# EAGLE schematic homeboard1tmp (EAGLE 6.0)
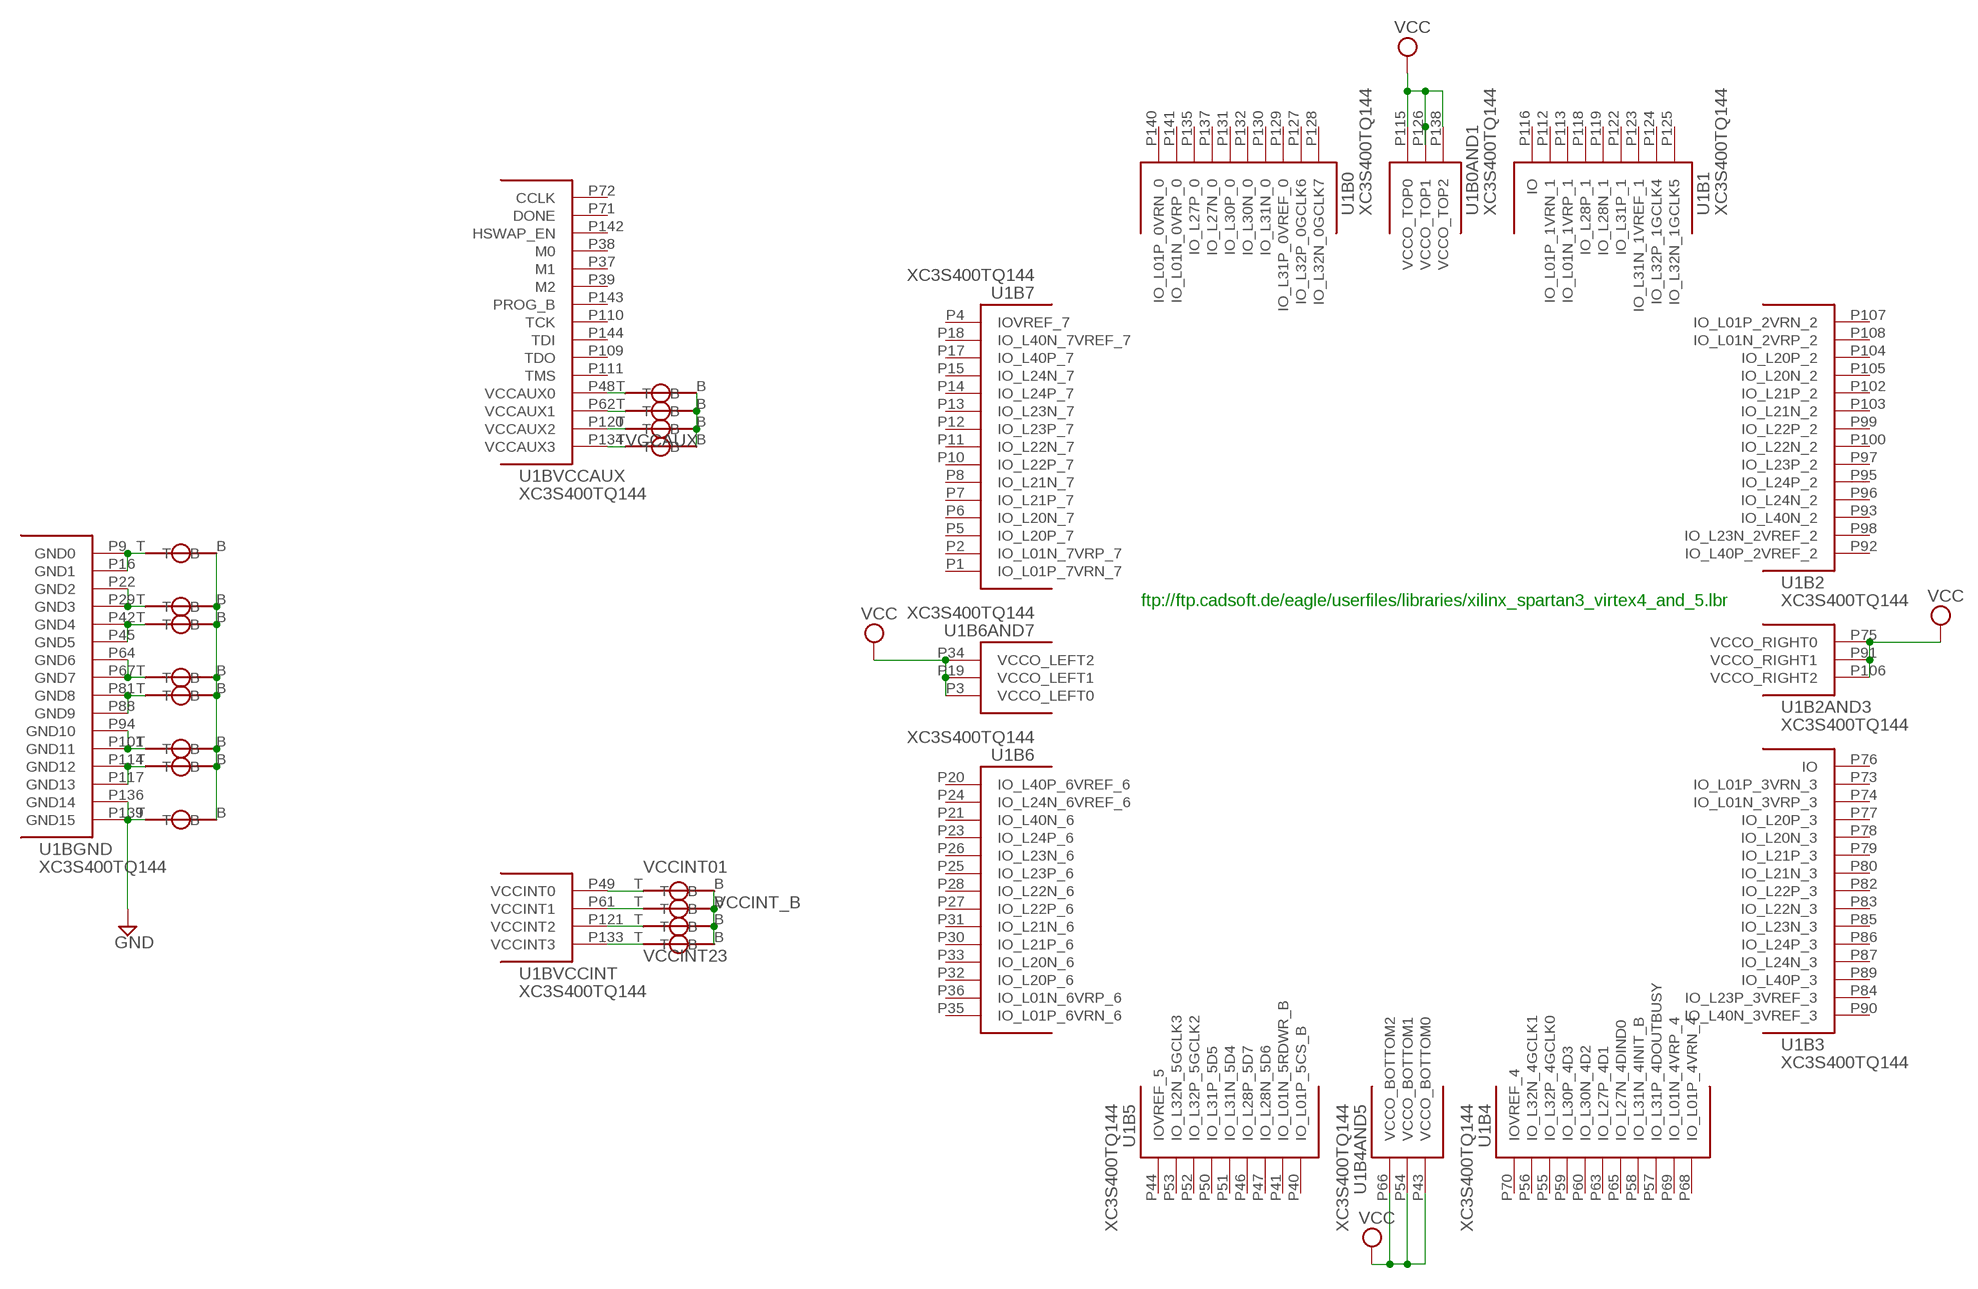
[diagram p0: schematic, sheet 1]

## Parts
U1  XC3S400TQ144  [TQ144]
U$1  VIA_DIY  [VIA_DIY]
U$2  VIA_DIY  [VIA_DIY]
U$3  VIA_DIY  [VIA_DIY]
U$4  VIA_DIY  [VIA_DIY]
U$5  VIA_DIY  [VIA_DIY]
U$8  VIA_DIY  [VIA_DIY]
U$9  VIA_DIY  [VIA_DIY]
U$12  VIA_DIY  [VIA_DIY]
U$13  VIA_DIY  [VIA_DIY]
U$16  VIA_DIY  [VIA_DIY]
U$17  VIA_DIY  [VIA_DIY]
U$20  VIA_DIY  [VIA_DIY]
U$21  VIA_DIY  [VIA_DIY]
U$22  VIA_DIY  [VIA_DIY]
U$23  VIA_DIY  [VIA_DIY]
U$24  VIA_DIY  [VIA_DIY]

## Nets
GND: U1.P136(BGND:GND14) U1.P139(BGND:GND15) U$20.T
GND_B: U$5.B U$8.B U$9.B U$12.B U$13.B U$16.B U$17.B U$20.B
N$1: U1.P9(BGND:GND0) U1.P16(BGND:GND1) U$5.T
N$2: U1.P42(BGND:GND4) U1.P45(BGND:GND5) U$9.T
N$4: U1.P22(BGND:GND2) U1.P29(BGND:GND3) U$8.T
N$8: U1.P64(BGND:GND6) U1.P67(BGND:GND7) U$12.T
N$9: U1.P81(BGND:GND8) U1.P88(BGND:GND9) U$13.T
N$12: U1.P94(BGND:GND10) U1.P101(BGND:GND11) U$16.T
N$13: U1.P114(BGND:GND12) U1.P117(BGND:GND13) U$17.T
N$16: U1.P48(BVCCAUX:VCCAUX0) U$22.T
N$17: U1.P133(BVCCINT:VCCINT3) U$24.T
N$18: U1.P61(BVCCINT:VCCINT1) U$23.T
N$19: U1.P134(BVCCAUX:VCCAUX3) U$21.T
N$20: U$3.B U$4.B U$21.B U$22.B
N$21: U1.P62(BVCCAUX:VCCAUX1) U$3.T
VCC: U1.P3(B6AND7:VCCO_LEFT0) U1.P19(B6AND7:VCCO_LEFT1) U1.P34(B6AND7:VCCO_LEFT2) U1.P43(B4AND5:VCCO_BOTTOM0) U1.P54(B4AND5:VCCO_BOTTOM1) U1.P66(B4AND5:VCCO_BOTTOM2) U1.P75(B2AND3:VCCO_RIGHT0) U1.P91(B2AND3:VCCO_RIGHT1) U1.P106(B2AND3:VCCO_RIGHT2) U1.P115(B0AND1:VCCO_TOP0) U1.P126(B0AND1:VCCO_TOP1) U1.P138(B0AND1:VCCO_TOP2)
VCCAUX: U1.P120(BVCCAUX:VCCAUX2) U$4.T
VCCINT01: U1.P49(BVCCINT:VCCINT0) U$1.T
VCCINT23: U1.P121(BVCCINT:VCCINT2) U$2.T
VCCINT_B: U$1.B U$2.B U$23.B U$24.B
Unconnected: U1.P1(B7:IO_L01P_7VRN_7) U1.P2(B7:IO_L01N_7VRP_7) U1.P4(B7:IOVREF_7) U1.P5(B7:IO_L20P_7) U1.P6(B7:IO_L20N_7) U1.P7(B7:IO_L21P_7) U1.P8(B7:IO_L21N_7) U1.P10(B7:IO_L22P_7) U1.P11(B7:IO_L22N_7) U1.P12(B7:IO_L23P_7) U1.P13(B7:IO_L23N_7) U1.P14(B7:IO_L24P_7) U1.P15(B7:IO_L24N_7) U1.P17(B7:IO_L40P_7) U1.P18(B7:IO_L40N_7VREF_7) U1.P20(B6:IO_L40P_6VREF_6) U1.P21(B6:IO_L40N_6) U1.P23(B6:IO_L24P_6) U1.P24(B6:IO_L24N_6VREF_6) U1.P25(B6:IO_L23P_6) U1.P26(B6:IO_L23N_6) U1.P27(B6:IO_L22P_6) U1.P28(B6:IO_L22N_6) U1.P30(B6:IO_L21P_6) U1.P31(B6:IO_L21N_6) U1.P32(B6:IO_L20P_6) U1.P33(B6:IO_L20N_6) U1.P35(B6:IO_L01P_6VRN_6) U1.P36(B6:IO_L01N_6VRP_6) U1.P37(BVCCAUX:M1) U1.P38(BVCCAUX:M0) U1.P39(BVCCAUX:M2) U1.P40(B5:IO_L01P_5CS_B) U1.P41(B5:IO_L01N_5RDWR_B) U1.P44(B5:IOVREF_5) U1.P46(B5:IO_L28P_5D7) U1.P47(B5:IO_L28N_5D6) U1.P50(B5:IO_L31P_5D5) U1.P51(B5:IO_L31N_5D4) U1.P52(B5:IO_L32P_5GCLK2) U1.P53(B5:IO_L32N_5GCLK3) U1.P55(B4:IO_L32P_4GCLK0) U1.P56(B4:IO_L32N_4GCLK1) U1.P57(B4:IO_L31P_4DOUTBUSY) U1.P58(B4:IO_L31N_4INIT_B) U1.P59(B4:IO_L30P_4D3) U1.P60(B4:IO_L30N_4D2) U1.P63(B4:IO_L27P_4D1) U1.P65(B4:IO_L27N_4DIND0) U1.P68(B4:IO_L01P_4VRN_4) U1.P69(B4:IO_L01N_4VRP_4) U1.P70(B4:IOVREF_4) U1.P71(BVCCAUX:DONE) U1.P72(BVCCAUX:CCLK) U1.P73(B3:IO_L01P_3VRN_3) U1.P74(B3:IO_L01N_3VRP_3) U1.P76(B3:IO) U1.P77(B3:IO_L20P_3) U1.P78(B3:IO_L20N_3) U1.P79(B3:IO_L21P_3) U1.P80(B3:IO_L21N_3) U1.P82(B3:IO_L22P_3) U1.P83(B3:IO_L22N_3) U1.P84(B3:IO_L23P_3VREF_3) U1.P85(B3:IO_L23N_3) U1.P86(B3:IO_L24P_3) U1.P87(B3:IO_L24N_3) U1.P89(B3:IO_L40P_3) U1.P90(B3:IO_L40N_3VREF_3) U1.P92(B2:IO_L40P_2VREF_2) U1.P93(B2:IO_L40N_2) U1.P95(B2:IO_L24P_2) U1.P96(B2:IO_L24N_2) U1.P97(B2:IO_L23P_2) U1.P98(B2:IO_L23N_2VREF_2) U1.P99(B2:IO_L22P_2) U1.P100(B2:IO_L22N_2) U1.P102(B2:IO_L21P_2) U1.P103(B2:IO_L21N_2) U1.P104(B2:IO_L20P_2) U1.P105(B2:IO_L20N_2) U1.P107(B2:IO_L01P_2VRN_2) U1.P108(B2:IO_L01N_2VRP_2) U1.P109(BVCCAUX:TDO) U1.P110(BVCCAUX:TCK) U1.P111(BVCCAUX:TMS) U1.P112(B1:IO_L01P_1VRN_1) U1.P113(B1:IO_L01N_1VRP_1) U1.P116(B1:IO) U1.P118(B1:IO_L28P_1) U1.P119(B1:IO_L28N_1) U1.P122(B1:IO_L31P_1) U1.P123(B1:IO_L31N_1VREF_1) U1.P124(B1:IO_L32P_1GCLK4) U1.P125(B1:IO_L32N_1GCLK5) U1.P127(B0:IO_L32P_0GCLK6) U1.P128(B0:IO_L32N_0GCLK7) U1.P129(B0:IO_L31P_0VREF_0) U1.P130(B0:IO_L31N_0) U1.P131(B0:IO_L30P_0) U1.P132(B0:IO_L30N_0) U1.P135(B0:IO_L27P_0) U1.P137(B0:IO_L27N_0) U1.P140(B0:IO_L01P_0VRN_0) U1.P141(B0:IO_L01N_0VRP_0) U1.P142(BVCCAUX:HSWAP_EN) U1.P143(BVCCAUX:PROG_B) U1.P144(BVCCAUX:TDI)

## Notes on the sheet
- ftp://ftp.cadsoft.de/eagle/userfiles/libraries/xilinx_spartan3_virtex4_and_5.lbr

## Library data of the parts
U1 = xilinx_spartan3_virtex4_and_5:XC3S400TQ144: Xilinx FPGA
U$1-U$5 U$8 U$9 U$12 U$13 U$16 U$17 U$20-U$24 = cpcfpga:VIA_DIY